# Altium project LEDBLINKING(AstableMultiVbrator).PrjPcb
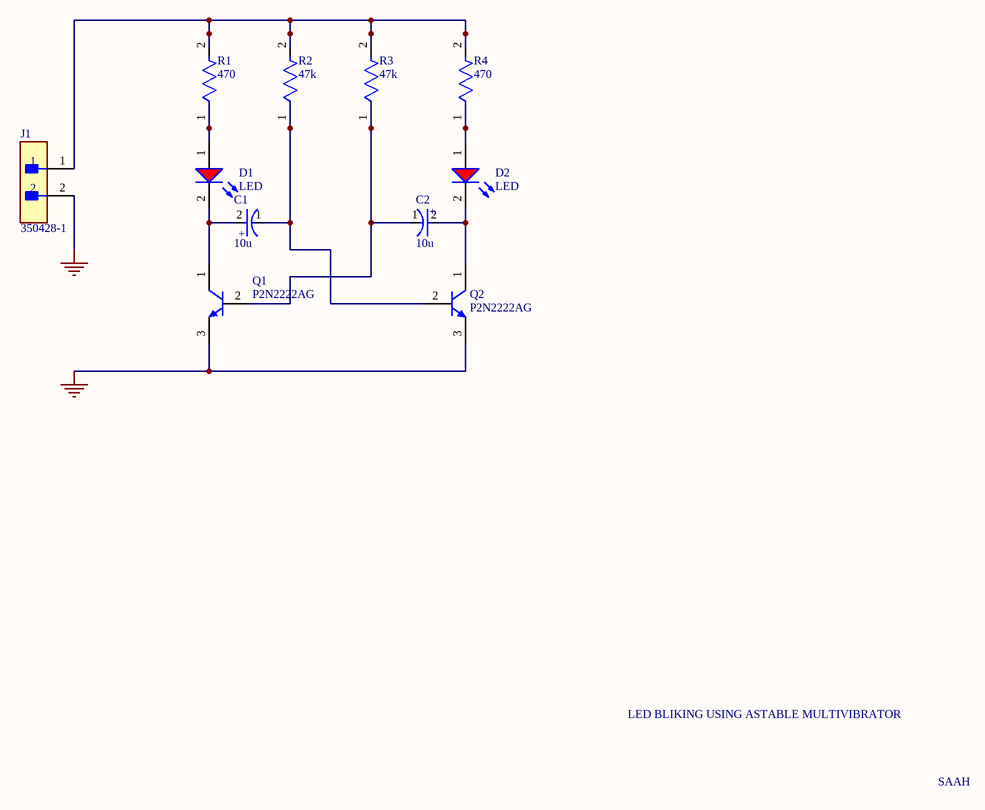
[diagram p0: LEDBLINKING(AstableMultiVbrator).SchDoc]
1 sheet, 11 parts. Net scope: global (net labels, ports and power ports of the same name join across sheets).
Board file: LEDBLINKING(AstableMultiVbrator).PcbDoc

## Sheet LEDBLINKING(AstableMultiVbrator).SchDoc
size A; SheetNumber: 1; SheetTotal: 1

### Parts
C1  10u  [FP-RAD-TH-D_12_5_0_5-L_20-MFG]
C2  10u  [FP-RAD-TH-D_12_5_0_5-L_20-MFG]
D1  LED  [WL-TMRC_D5.9H8.7]
D2  LED  [WL-TMRC_D5.9H8.7]
J1  350428-1  [FP-350428-1-MFG]
Q1  P2N2222AG  [ONSC-TO-92-3-29-11]
Q2  P2N2222AG  [ONSC-TO-92-3-29-11]
R1  470  [FP-CF14-MFG]
R2  47k  [FP-CF14-MFG]
R3  47k  [FP-CF14-MFG]
R4  470  [FP-CF14-MFG]

### Nets
GND: J1.2 Q1.3(E) Q2.3(E)
NetC1_1: C1.1(C) Q2.2(B) R2.1
NetC1_2: C1.2(A) D1.2(K) Q1.1(C)
NetC2_1: C2.1(C) Q1.2(B) R3.1
NetC2_2: C2.2(A) D2.2(K) Q2.1(C)
NetD1_1: D1.1(A) R1.1
NetD2_1: D2.1(A) R4.1
NetJ1_1: J1.1 R1.2 R2.2 R3.2 R4.2

### Notes on the sheet
- LED BLIKING USING ASTABLE MULTIVIBRATOR
- SAAH
- (in symbol CMP-05427-000380-1) +

### Library data of the parts
C1 C2 = CMP-05427-000380-1: Aluminum Electrolytic Capacitors (Radial Lead Type) 10uF ±20% 450V; Life (Hours): 10000Hour; Lead Diameter: 0.6mm; Leakage Current: 280uA; Dissipation Factor: 0.24%; Ripple Current: 490mA; Lead Pitch: 5mm; Packaging: Bulk; Min Operating Temperature: -25°C; Package Quantity: 200; Case/Package: Radial; Height - Seated (Max): 0.787inch; Max Operating Temperature: 105°C; Radiation Hardening: No; Lead Free: Lead Free; Series: EE; Capacitance: 10uF; Diameter: 12.5mm; Tolerance: 20%; Termination: Radial; RoHS Compliant: Yes; Voltage Rating: 450V; REACH SVHC: No SVHC; Voltage Rating (DC): 450V; Height: 20mm; Construction: RADIAL; Voltage: 450V; Length: 20mm; Mount: Through Hole
D1 D2 = CMP-03913-71241449-1: 151051SS04000 WL-TMRC THT Mono-color Round Color; Viewing Angle: 40°; Dominant Wavelength: 635nm; Forward Current: 100mA; Forward Voltage: 2.1V; Luminous Intensity: 250mcd; Max Reverse Voltage (DC): 5V; Peak Wavelength: 640nm; Height: 8.6mm; Packaging: Bulk; Mount: Through Hole; Width: 5mm; Min Operating Temperature: -40°C; Wavelength: 635nm; Max Operating Temperature: 85°C; RoHS: Compliant; Length: 5mm; NexarPartId: 71241449
J1 = CMP-03369-000080-1: CONN HEADER VERT 2POS 6.35MM; Manufacturer: TE Connectivity; Standoff Height: 0.63mm; Number Of Contacts: 2; Conn Gender: Male; Voltage Rating: 600V; Conn Orientation: Vertical; Current Rating: 12A; Number Of Rows: 1; Mouser Description: Connector, Soft Shell; Universal MATE-N-LOK; 2; Nylon; Natural; 19 A; 600 VAC; Height: 14.99mm; Pitch: 6.35mm; ComponentLink2URL: https://www.te.com/commerce/DocumentDelivery/DDEController?Action=showdoc&DocId=Customer+Drawing%7F350428%7FY2%7Fpdf%7FEnglish%7FENG_CD_350428_Y2.pdf%7F350428-1; Device Class L1: Connectors; Automotive: No; Octopart: https://octopart.com/350428-1-te+connectivity-46505355; Digikey Description: CONN HEADER VERT 2POS 6.35MM; RoHS: TRUE; Temperature: -40°C to +105°C; Contact Material: Gold,Nickel; Package: 350428-1; Temperature Range Low: -40°C; Device Class L3: unset; Lead Free: Yes; Device Class L2: Headers and Wire Housings; Category: Conn; ComponentLink2Description: Datasheet; Temperature Range High: +105°C; Manufacturer Part Number: 350428-1
Q1 Q2 = CMP-1048-01402-1: Amplifier Transistor, NPN Silicon, 3-Pin TO-92, Pb-Free, Bulk Box; Manufacturer: On Semiconductor; IC Continuous (A): 0.6; fT Min (MHz): 300; ComponentLink2Description: Datasheet; ComponentLink1Description: Manufacturer URL; ComponentLink2URL: http://www.onsemi.com/pub_link/Collateral/P2N2222A-D.PDF; ComponentLink3Description: Package Specification; RoHS: TRUE; ComponentLink1URL: http://www.onsemi.com/; PartNumber: P2N2222AG; Mounting Technology: Through Hole; PackageReference: TO-92-3-29-11_AM_SL; Polarity: NPN; Packing: Bulk Box; DatasheetVersion: Rev. 7; PackageDescription: 3-Pin Transistor Outline, Body 4.825 x 3.685 mm, Pitch 1.27 mm; PackageVersion: Rev. AM; ComponentLink3URL: http://www.onsemi.cn/pub_link/Collateral/2N6426-D.PDF
R1-R4 = CMP-26528-000003-1: RES 7.5K OHM 1/4W 5% AXIAL; Max Power Dissipation: 250mW; Temperature Coefficient: -400ppm/°C; Resistance: 7.5kR; RoHS Compliant: Yes; Lead Free: Lead Free; Max Operating Temperature: 155°C; Case/Package: Axial; Tolerance: 5%; Power Rating: 250mW; Diameter: 2.3mm; Features: Flame Retardant Coating; Series: CF; Resistor Type: Carbon Film; Number of Terminations: 2; Length: 0.256inch; Min Operating Temperature: -55°C; Contact Plating: Tin; Packaging: Tape and Reel; Mount: Through Hole; Radiation Hardening: No